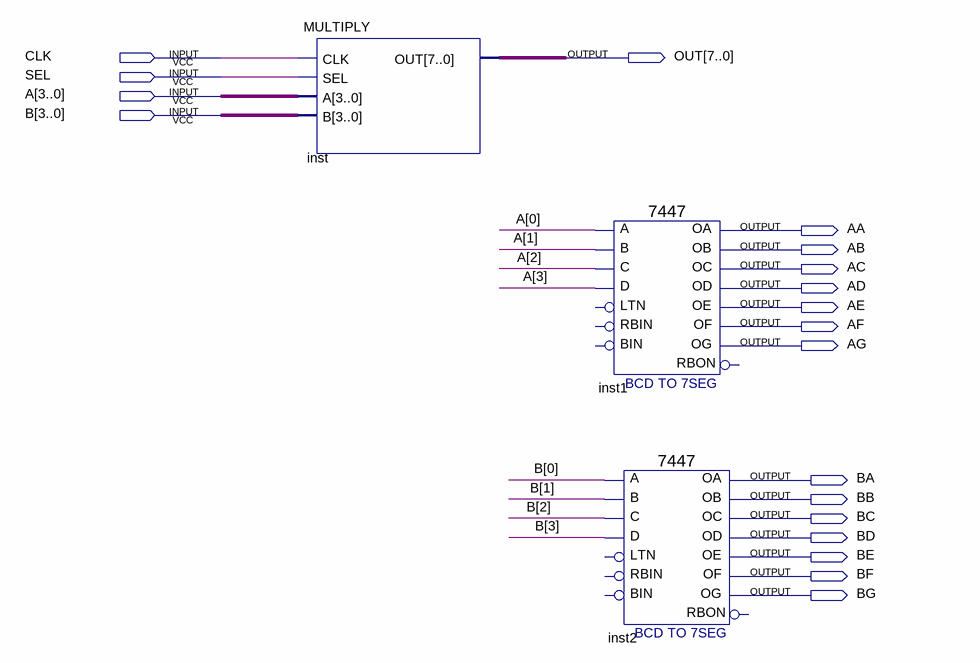
[diagram p0: schematic sheet]
// Quartus schematic TOP.bdf as structural Verilog: 3 symbols, 19 pins
module TOP (
  input  CLK,
  input  SEL,
  input  [3:0] A,
  input  [3:0] B,
  output [7:0] OUT,
  output AA,
  output AB,
  output AC,
  output AD,
  output AE,
  output AF,
  output AG,
  output BA,
  output BB,
  output BC,
  output BD,
  output BE,
  output BF,
  output BG
);

  MULTIPLY inst (.CLK(CLK), .SEL(SEL), .A(A), .B(B), .OUT(OUT));
  \7447  inst1 (
    .B(A[1]), .C(A[2]), .D(A[3]), .A(A[0]), .OB(AB), .OC(AC), .OE(AE), .OD(AD), .OF(AF), .OG(AG), .OA(AA));  // open: LTN, RBIN, BIN, RBON
  \7447  inst2 (
    .B(B[1]), .C(B[2]), .D(B[3]), .A(B[0]), .OB(BB), .OC(BC), .OE(BE), .OD(BD), .OF(BF), .OG(BG), .OA(BA));  // open: LTN, RBIN, BIN, RBON
endmodule
